# Altium schematic sheet Tutorial Sheet.SchDoc: Wackyraces Hat Main Schemetic
size A3; DrawnBy: Nathan James; Address1: ECE Department; Address2: University of Canterbury; Address3: Christchurch 8041; Address4: New Zealand; Revision: 1
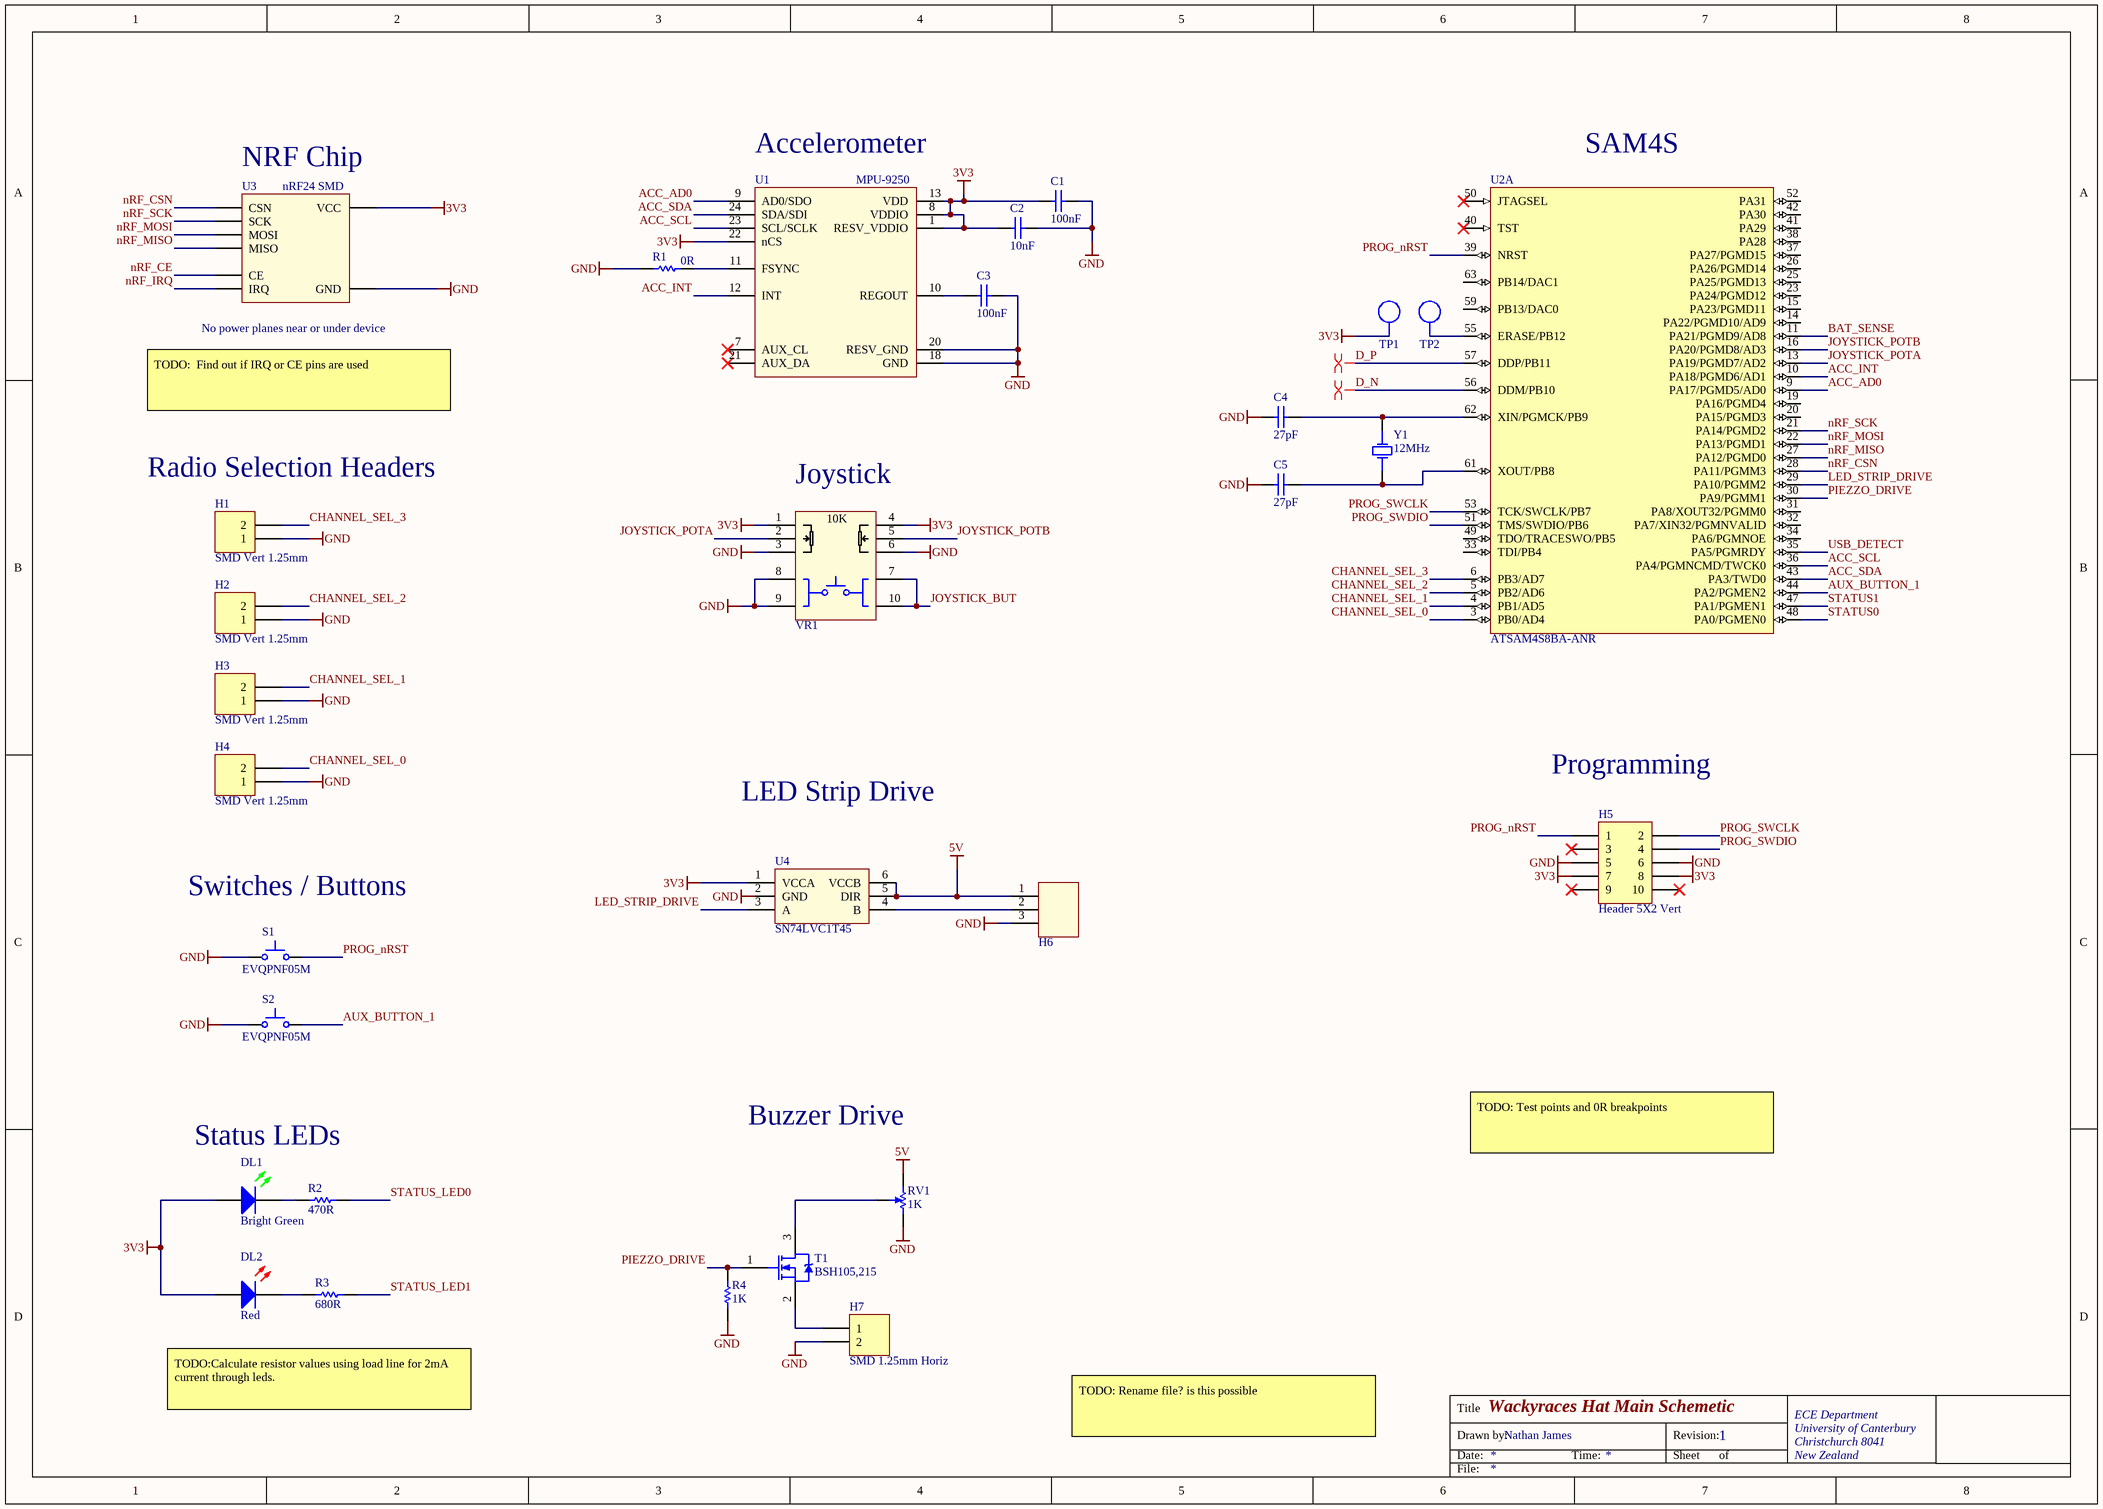
[diagram p0: Tutorial Sheet.SchDoc]

## Parts
C1  100nF  [CAPC1608L]
C2  10nF  [CAPC1608L]
C3  100nF  [CAPC1608L]
C4  27pF  [CAPC1608L]
C5  27pF  [CAPC1608L]
DL1  Bright Green  [WL-SMCW0603]
DL2  Red  [WL-SMCW0603]
H1  SMD Vert 1.25mm  [SD-53398-0219]
H2  SMD Vert 1.25mm  [SD-53398-0219]
H3  SMD Vert 1.25mm  [SD-53398-0219]
H4  SMD Vert 1.25mm  [SD-53398-0219]
H5  Header 5X2 Vert  [IDC2.54-V10D]
H6  HEADER_3  [HEADER_3POS]  (value not drawn)
H7  SMD 1.25mm Horiz  [SD-53261-0219]
R1  0R  [RESC1608L]
R2  470R  [RESC1608L]
R3  680R  [RESC3216L]
R4  1K  [RESC1608L]
RV1  1K  [PVZ2A]
S1  EVQPNF05M  [EVQPNF05M]
S2  EVQPNF05M  [EVQPNF05M]
T1  BSH105,215  [SOT23_L]
TP1  Erase  [TP_1206]  (value not drawn)  (no BOM)
TP2  Erase  [TP_1206]  (value not drawn)  (no BOM)
U1  MPU-9250  [Quad24]
U2  ATSAM4S8BA-ANR  [LQFP64_L]  (part A of 2)
U3  nRF24 SMD  Warning: No power planes near or under device  [NRF24]
U4  SN74LVC1T45  [SOT23-6_N]
VR1  Joystick 10k with Sw  [Joystick_Sw]  (value not drawn)
Y1  12MHz  [6.0X3.5-4]

## Nets
3V3: C1.1 C2.1 DL1.2(A) DL2.2(A) H5.7 H5.8 TP1.1 U1.1(RESV_VDDIO) U1.8(VDDIO) U1.13(VDD) U1.22(nCS) U3.1(VCC) U4.1(VCCA) VR1.1 VR1.4(1')
5V: H6.1 RV1.3(-) U4.5(DIR) U4.6(VCCB)
GND: C1.2 C2.2 C3.2 C4.1 C5.1 H1.1 H2.1 H3.1 H4.1 H5.5 H5.6 H6.3 H7.2 R1.1 R4.1 RV1.1 S1.1 S2.1 U1.18(GND) U1.20(RESV_GND) U3.2(GND) VR1.3 VR1.6(3') VR1.8 VR1.9
ACC_AD0: U1.9(AD0/SDO) U2.9(PA17/PGMD5/AD0)
ACC_INT: U1.12(INT) U2.10(PA18/PGMD6/AD1)
ACC_SCL: U1.23(SCL/SCLK) U2.36(PA4/PGMNCMD/TWCK0)
ACC_SDA: U1.24(SDA/SDI) U2.43(PA3/TWD0)
AUX_BUTTON_1: S2.2 U2.44(PA2/PGMEN2)
BAT_SENSE: U2.11(PA21/PGMD9/AD8)
CHANNEL_SEL_0: H4.2 U2.3(PB0/AD4)
CHANNEL_SEL_1: H3.2 U2.4(PB1/AD5)
CHANNEL_SEL_2: H2.2 U2.5(PB2/AD6)
CHANNEL_SEL_3: H1.2 U2.6(PB3/AD7)
D_N: U2.56(DDM/PB10)
D_P: U2.57(DDP/PB11)
JOYSTICK_BUT: VR1.7 VR1.10
JOYSTICK_POTA: U2.13(PA19/PGMD7/AD2) VR1.2
JOYSTICK_POTB: U2.16(PA20/PGMD8/AD3) VR1.5(2')
LED_STRIP_DRIVE: U2.29(PA10/PGMM2) U4.3(A)
nRF_CE: U3.3(CE)
nRF_CSN: U2.28(PA11/PGMM3) U3.4(CSN)
nRF_IRQ: U3.8(IRQ)
nRF_MISO: U2.27(PA12/PGMD0) U3.7(MISO)
nRF_MOSI: U2.22(PA13/PGMD1) U3.6(MOSI)
nRF_SCK: U2.21(PA14/PGMD2) U3.5(SCK)
PIEZZO_DRIVE: R4.2 T1.1 U2.30(PA9/PGMM1)
PROG_nRST: H5.1 S1.2 U2.39(NRST)
PROG_SWCLK: H5.2 U2.53(TCK/SWCLK/PB7)
PROG_SWDIO: H5.4 U2.51(TMS/SWDIO/PB6)
STATUS0: U2.48(PA0/PGMEN0)
STATUS1: U2.47(PA1/PGMEN1)
STATUS_LED0: R2.2
STATUS_LED1: R3.2
USB_DETECT: U2.35(PA5/PGMRDY)
NetC3_1: C3.1 U1.10(REGOUT)
NetC4_2: C4.2 U2.62(XIN/PGMCK/PB9) Y1.3(OSC2)
NetC5_2: C5.2 U2.61(XOUT/PB8) Y1.1(OSC1)
NetDL1_1: DL1.1(K) R2.1
NetDL2_1: DL2.1(K) R3.1
NetH6_2: H6.2 U4.4(B)
NetH7_1: H7.1 T1.2
NetR1_2: R1.2 U1.11(FSYNC)
NetRV1_2: RV1.2(W) T1.3
NetTP2_1: TP2.1 U2.55(ERASE/PB12)

Not connected (* = marked no-connect by the designer): H5 3* 9* 10*; U1 7(AUX_CL)* 21(AUX_DA)*; U2 14(PA22/PGMD10/AD9) 15(PA23/PGMD11) 19(PA16/PGMD4) 20(PA15/PGMD3) 23(PA24/PGMD12) 25(PA25/PGMD13) 26(PA26/PGMD14) 31(PA8/XOUT32/PGMM0) 32(PA7/XIN32/PGMNVALID) 33(TDI/PB4) 34(PA6/PGMNOE) 37(PA27/PGMD15) 38(PA28) 40(TST)* 41(PA29) 42(PA30) 49(TDO/TRACESWO/PB5) 50(JTAGSEL)* 52(PA31) 59(PB13/DAC0) 63(PB14/DAC1); U4 2(GND)

## Layout directives
differential pair: D_N, D_P

## Notes on the sheet
- (near U3) NRF Chip
- (near U1) Accelerometer
- (near U2) SAM4S
- TODO:  Find out if IRQ or CE pins are used
- (near H1) Radio Selection Headers
- (near VR1) Joystick
- Programming
- LED Strip Drive
- Switches / Buttons
- Buzzer Drive
- Status LEDs
- TODO: Test points and 0R breakpoints
- TODO:Calculate resistor values using load line for 2mA current through leds.
- TODO: Rename file? is this possible
- Labels drawn without touching a wire or pin: GND
- Title
- Drawn by:
- Date:
- Time:
- Revision:
- Sheet
- of
- File:
- (in symbol Joystick 10k with Sw) 10K

## Library data of the parts
C1 C3 = CC_100nF_0603: CAP CER 100nF X7R +-10% 50V 0603; PackageReference: 0603; Code_IPC: 1608 [0603]; Verify: *; Supplier: ECE Dept; Storage Location: PCB Assembly WS; Value: 100nF
C2 = CC_10nF_0603: CAP CER 10nF X7R +-10% 50V 0603; PackageReference: 0603; Code_IPC: 1608 [0603]; Verify: *; Supplier: ECE Dept; Storage Location: PCB Assembly WS; Value: 10nF
C4 C5 = CC_27pF_0603: CAP CER 27pF NPO/COG +-5% 50V 0603; PackageReference: 0603; Code_IPC: 1608 [0603]; Verify: *; Supplier: ECE Dept; Storage Location: PCB Assembly WS; Value: 27pF
DL1 = DL_150060VS75000: LED Bright Green 40mcd 0603 SMD; Manufacturer: WURTH ELEKTRONIK; Forward Current If: 30; Forward Voltage: 2; Viewing Angle: 140°; Wavelength Typ: 570; Luminous Intensity: 40; LED Mounting: SMD; Supplier 1: Farnell; Supplier Part Number 1: 2322073; Manufacturer Part Number: 150060VS75000; Storage Location: PCB Assembly WS; Supplier: ECE Dept; LED Colour: Bright Green
DL2 = DL_150060RS75000: LED Red 250mcd 0603 SMD; Manufacturer: WURTH ELEKTRONIK; Forward Current If: 30; Forward Voltage: 2; Lens Shape: Rectangular; Luminous Intensity: 250; Wavelength Typ: 625; Viewing Angle: 140°; LED Mounting: SMD; Supplier 1: Farnell; Supplier Part Number 1: 2322071; Manufacturer Part Number: 150060RS75000; Storage Location: PCB Assembly WS; Supplier: ECE Dept; LED Colour: Red
H1-H4 = JB_53398-02: Header_Vert_2Pos_1.25mm_125V@1A_SMT; Manufacturer: Molex Inc; Manufacturer Part Number: 0533980271; Number of Positions: 2; Pitch: 0.049" (1.25mm); Contact Type: Blade Pin; Mounting Type: Surface Mount; Supplier 1: Digi-Key; Supplier Part Number 1: WM7606CT-ND; Supplier: ECE Dept; Storage Location: PCB Assembly WS; Value: SMD Vert 1.25mm
H5 = JA_HDR_IDC_5X2_VERT: IDC Header, 2,54mm, 10-Pin, Vert; Supplier: ECE Dept; Supplier 1: Farnell; Supplier Part Number 1: 1096985; Storage Location: ECE Dept Store
H6 = HEADER_3: 3Pin Header 2.54mm spacing
H7 = JB_53261-02: Header_Horiz_2Pos_1.25mm_125V@1A_SMT; Manufacturer: MOLEX; Manufacturer Part Number: 53261-0271; External Depth: 4.2; External Length / Height: 3.4; Gender: Header; No. of Contacts: 2; Pitch Spacing: 1.25; Voltage Rating V AC: 125; Contact Termination: Surface Mount Right Angle; Lead Spacing: 1.25; Series: PicoBlade; Pricing: 5=0.27, 100=0.255, 250=0.245, 500=0.225, 1000=0.205 (NZD); Supplier 1: Farnell; Supplier Part Number 1: 1125373; Supplier 2: Digi-Key; Supplier Part Number 2: WM7620CT-ND; Supplier: ECE Dept; Storage Location: PCB Assembly WS; Value: SMD 1.25mm Horiz
R1 = RS_0R0: RES 0.0 OHM 1/10W 5% 0603 SMD; Storage Location: PCB Assembly WS; Supplier: ECE Dept; Value: 0R
R2 = RS_470R: RES 470 OHM 1/10W 5% 0603 SMD; Storage Location: PCB Assembly WS; Supplier: ECE Dept; Value: 470R
R3 = RT_680R: RES 680R OHM 1/4W 5% 1206 SMD; Storage Location: PCB Assembly WS; Supplier: ECE Dept; Value: 680R
R4 = RS_1K: RES 1.0K OHM 1/10W 5% 0603 SMD; Storage Location: PCB Assembly WS; Supplier: ECE Dept; Value: 1K
RV1 = RM_1K: Trim Pot SMD 1K Murata PVZ2 Series SMD; Manufacturer Part Number: PVZ2A102C04B00; External Depth: 2.7; External Length / Height: 0.85; External Width: 2.1; No. of Turns: 1; Power Rating: 50; Resistor Element Material: Metal Foil; Manufacturer: MURATA; Storage Location: PCB Assembly WS; Potentiometer Mounting: SMD; Supplier 1: Farnell; Supplier Part Number 1: 1771721; Supplier: ECE Dept; Value: 1K
S1 S2 = WS_EVQPNF05M: Panasonic 6 x 3.5mm SMD Light Touch Switch Type SMD; PackageDescription: 6.0 x 3.5 mm; Supplier 1: Farnell; Supplier Part Number 1: 2079481; Manufacturer: Panasonic; Manufacturer PN: EVQPNF05M; Supplier 2: Digi-Key; Supplier Part Number 2: P13598SCT-ND; Storage Location: PCB Assembly WS; Supplier: ECE Dept
T1 = TM_BSH105: MOSFET N-CH 20V 1.05A SOT-23; Manufacturer: NXP Semiconductors; FET Type: MOSFET N-Channel, Metal Oxide; Gate Charge (Qg) @ Vgs: 3.9nC @ 4.5V; Input Capacitance (Ciss) @ Vds: 152pF @ 16V; Power - Max: 417mW; Rds On (Max) @ Id, Vgs: 200 mOhm @ 600mA, 4.5V; Supplier 1: Farnell; Supplier 2: Digi-Key; Current - Continuous Drain (Id) @ 25° C: 1.05A; Drain to Source Voltage (Vdss): 20V; Package / Case: TO-236-3, SC-59, SOT-23-3; Pricing: 1=0.53, 10=0.42, 25=0.3544, 100=0.2885, 250=0.23896, 500=0.1974, 1000=0.14785 (NZD); Supplier Part Number 1: 1758066; Supplier Part Number 2: 568-6215-1-ND; Storage Location: PCB Assembly WS; Supplier: ECE Dept; Manufacturer Part Number: BSH105,215
TP1 TP2 = TP_1206: Test-Point 3.3x1.6x2.1mm SMD; Manufacturer: Harwin Inc; Manufacturer Part Number: S1751-46R; Value: TP; Manufacturer PN: *; Storage Location: ProtoPlace; Mounting Type: Surface Mount; Type: PC Test Point; Supplier 1: Digi-Key; Supplier Part Number 1: 952-1478-2-ND; Supplier 2: Farnell; Supplier Part Number 2: 1826282; Supplier: ECE Dept
U1 = MPU-9250: 9 axis IMU
U2 = SE_ATSAM4S16BA-MU: IC MCU 32BIT 512KB FLASH 64LQFP; Manufacturer: Atmel; Connectivity: I²C, IrDA, Memory Card, SPI, SSC, UART/USART, USB; Core Processor: ARM® Cortex®-M4; Core Size: 32-Bit; Data Converters: A/D 11x12b, D/A 2x12b; Number of I/O: 47; Peripherals: Brown-out Detect/Reset, DMA, POR, PWM, WDT; Program Memory Size: 512KB (512K x 8); RAM Size: 128K x 8; Speed: 120MHz; Voltage - Supply (Vcc/Vdd): 1.62 V ~ 3.6 V; PackageVersion: revJ, Jul-2007; PackageReference: 64PS; PackageDescription: 64-Pin Quad Flat No-Lead (QFN) Sawn, 9 x 9 x 1.0 mm Body, 0.5 mm Pitch, Exposed Pad; Code_JEDEC: MO-220VMMD-3; ComponentLink1Description: Manufacturer URL; ComponentLink1URL: http://www.atmel.com/; ComponentLink2Description: SAM4S Series Datasheet; ComponentLink2URL: http://www.atmel.com/dyn/resources/prod_documents/11100.pdf; ComponentLink3Description: SAM4S Series Summary; ComponentLink3URL: http://www.atmel.com/dyn/resources/prod_documents/11100S.pdf; Supplier 1: Digi-Key; Package / Case: 64-LQFP; Packaging: Cut Tape (CT); Program Memory Type: FLASH; Supplier Part Number 1: ATSAM4S8BA-ANRCT-ND; Manufacturer Part Number: ATSAM4S8BA-ANR
U3 = NRF24: nRF24 SMD Module
U4 = SN74LVC1T45: 1.8V - 5V level converter
VR1 = Joystick 10k with Sw: JOYSTICK 10K OHM 2 AXIS TH; Manufacturer 1: SparkFun; Manufacturer Part Number 1: COM-09032; Supplier 1: Digi-Key; Stock 1: 563; Pricing 1: 1=3.95000 (USD); RoHS: No; ComponentLink1URL: https://media.digikey.com/pdf/Data%20Sheets/Sparkfun%20PDFs/COM-09032_Web.pdf?src-supplier=Digi-Key; ComponentLink1Description: https://media.digikey.com/pdf/Data%20Sheets/Sparkfun%20PDFs/COM-09032_Web.pdf?src-supplier=Digi-Key; Supplier Part Number 1: 1568-1526-ND
Y1 = XT_CRYSTAL_12MHz_18pF: CRYSTAL 12MHZ 18PF 6X3.5mm SMD; Manufacturer: CTS-Frequency Controls; Manufacturer Part Number: 406C35D12M00000; ESR (Equivalent Series Resistance): 60 Ohm; Frequency Stability: ±50ppm; Frequency Tolerance: ±30ppm; Operating Mode: Fundamental; Supplier 1: Digi-Key; Height: 0.047" (1.20mm); Load Capacitance: 18pF; Mounting Type: Surface Mount; Operating Temperature: -20°C ~ 70°C; Package / Case: 4-SMD, No Lead (DFN, LCC); Size / Dimension: 0.236" L x 0.138" W (6.00mm x 3.50mm); Supplier Part Number 1: CTX855CT-ND; Frequency: 12MHz